# EAGLE design 2svd (EAGLE 6.4)
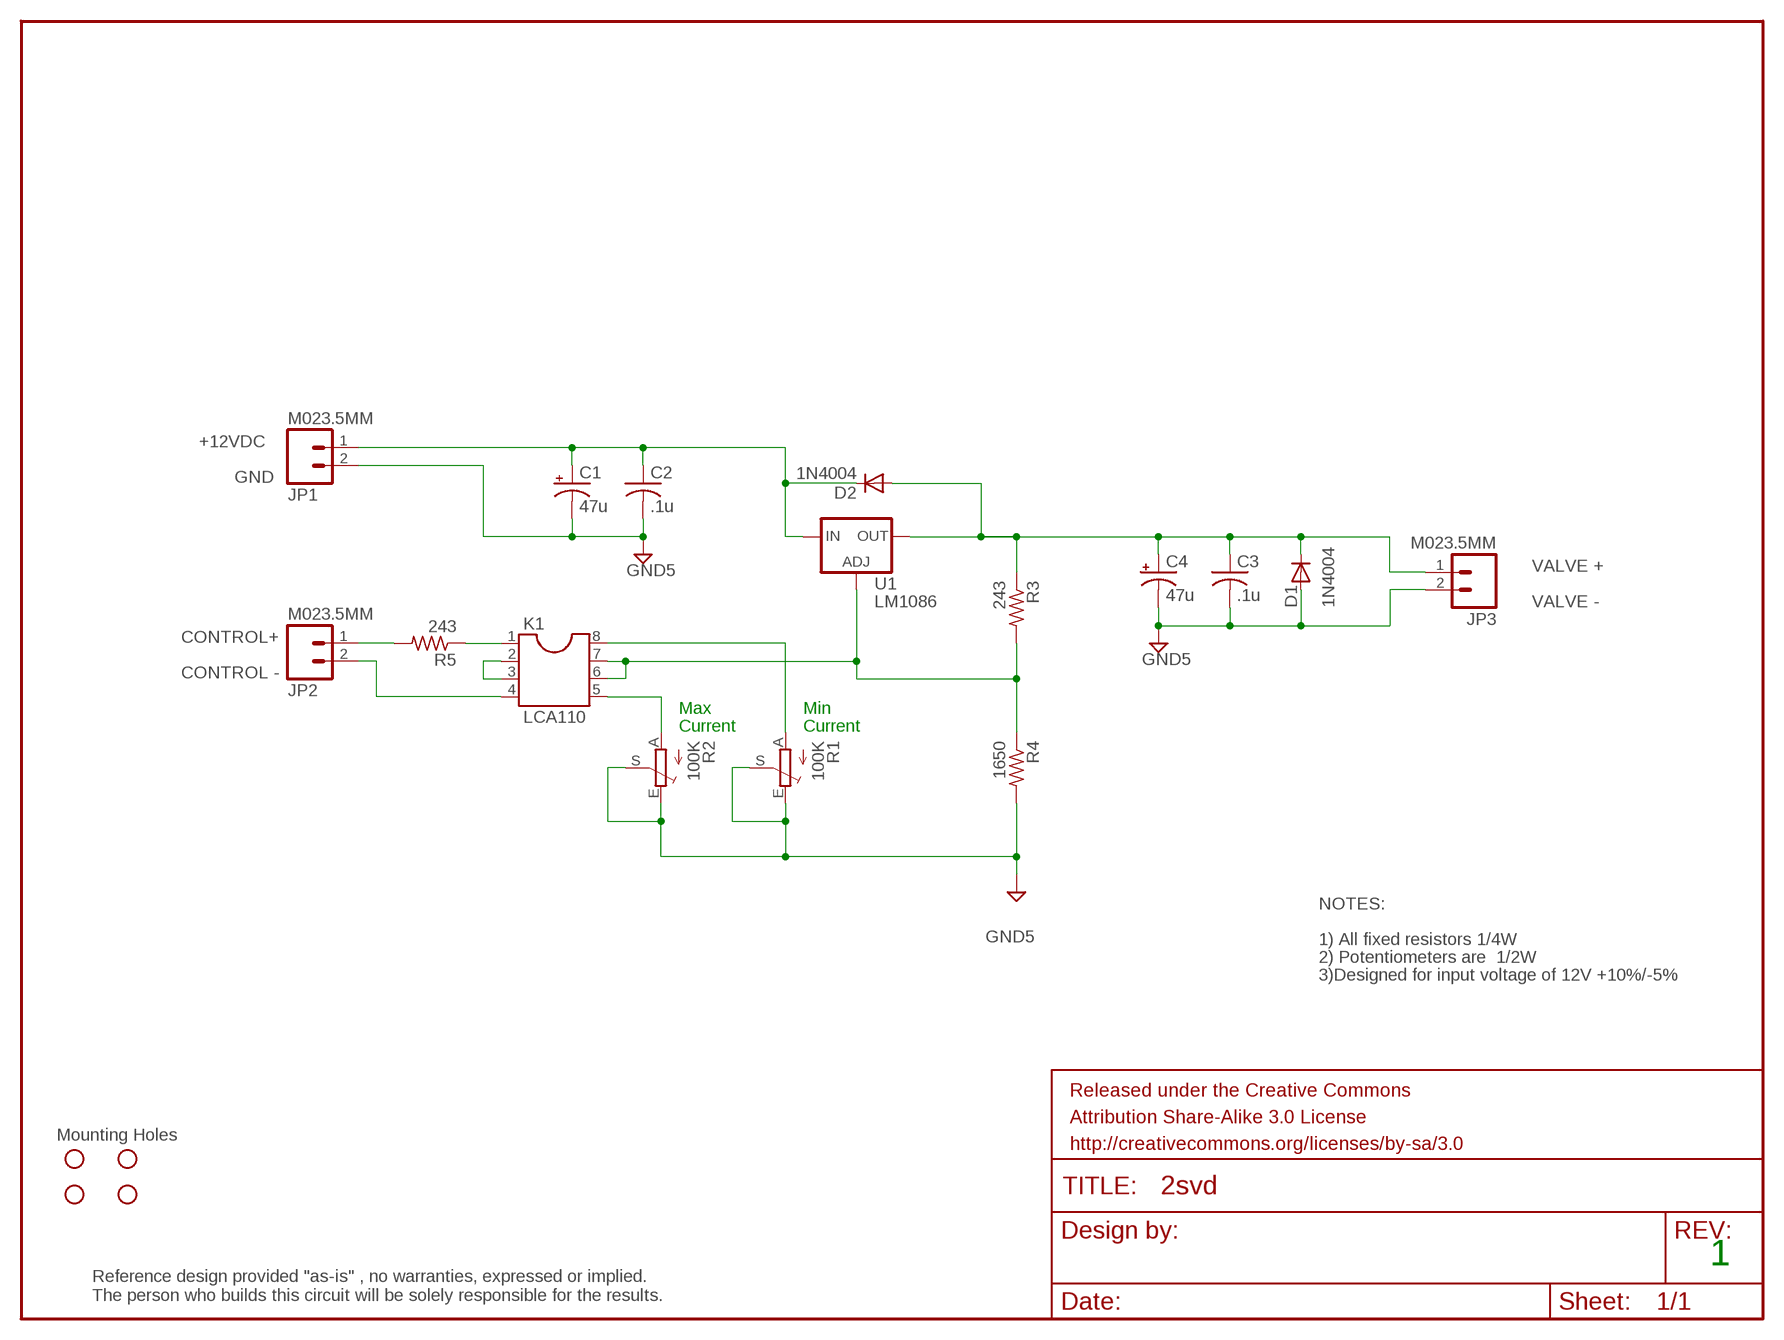
[diagram p0: schematic, sheet 1]

## Parts
C1  47u  CAP_POLPTH2  [CPOL-RADIAL-10UF-25V]
C2  .1u  C-US075-032X103  [C075-032X103]
C3  .1u  C-US075-032X103  [C075-032X103]
C4  47u  CAP_POLPTH2  [CPOL-RADIAL-10UF-25V]
D1  1N4004  [DO41-10]
D2  1N4004  [DO41-10]
FRAME1  FRAME-LETTER  [CREATIVE_COMMONS]
H1  STAND-OFF  [STAND-OFF]
H2  STAND-OFF  [STAND-OFF]
H3  STAND-OFF  [STAND-OFF]
H4  STAND-OFF  [STAND-OFF]
JP1  M023.5MM  [SCREWTERMINAL-3.5MM-2]
JP2  M023.5MM  [SCREWTERMINAL-3.5MM-2]
JP3  M023.5MM  [SCREWTERMINAL-3.5MM-2]
K1  LCA110  DIL8  [DIL08]
R1  100K  TRIM_EU-RJ9W  [RJ9W]
R2  100K  TRIM_EU-RJ9W  [RJ9W]
R3  243  R-US_0207/10  [0207/10]
R4  1650  R-US_0207/10  [0207/10]
R5  243  R-US_0207/10  [0207/10]
U1  LM1086  LM317TS  [317TS]

## Nets
N$1: K1.6 K1.7 R3.2 R4.1 U1.1(ADJ)
N$3 [power]: C3.1 C4.1(+) D1.C D2.A JP3.1 R3.1 U1.2(OUT)
N$4: K1.5 R2.A
N$5: K1.8 R1.A
N$7: K1.1 R5.1
N$9: K1.2 K1.3
N$10: JP2.2 K1.4
N$11 [power]: C1.1(+) C2.1 D2.C JP1.1 U1.3(IN)
N$12: JP2.1 R5.2
PE [gnd]: C1.2(-) C2.2 C3.2 C4.2(-) D1.A JP1.2 JP3.2 R1.E R1.S R2.E R2.S R4.2 ; supply symbol labelled GND5

## Notes on the sheet
- +12VDC
- GND
- VALVE +
- VALVE -
- CONTROL+
- CONTROL -
- Max | Min
- Current | Current
- NOTES:
- 1) All fixed resistors 1/4W
- 2) Potentiometers are  1/2W
- 3)Designed for input voltage of 12V +10%/-5%
- Mounting Holes
- 1
- Reference design provided "as-is" , no warranties, expressed or implied.
  The person who builds this circuit will be solely responsible for the results.

## Library data of the parts
C1 C4 = SparkFun-Capacitors:CAP_POL: Capacitor Polarized These are standard SMD and PTH capacitors. Normally 10uF, 47uF, and 100uF in electrolytic and tantalum varieties. Always verify the external diameter of the through hole cap, it varies with capacity, voltage, and manufacturer. The EIA devices should be standard.
C2 C3 = resistor:C-US: CAPACITOR, American symbol
D1 D2 = diode:1N4004: DIODE general purpose rectifier, 1 A
FRAME1 = SparkFun-Aesthetics:FRAME-LETTER: Schematic Frame Standard 8.5x11 US Letter frame
H1-H4 = SparkFun-Electromechanical:STAND-OFF: #4 Stand Off This is the mechanical footprint for a #4 phillips button head screw. Use the keepout ring to avoid running the screw head into surrounding components. SKU : PRT-00447
JP1-JP3 = SparkFun-Connectors:M02: Standard 2-pin 0.1" header. Use with - straight break away headers ( PRT-00116) - right angle break away headers (PRT-00553) - swiss pins (PRT-00743) - machine pins (PRT-00117) - female headers (PRT-00115) Molex polarized connector foot print use with: PRT-08233 with associated crimp pins and housings. 2.54_SCREWTERM for use with PRT-10571. 3.5mm Screw Terminal footprints for PRT-08084 5mm Screw Terminal footprints for use with PRT-08433
K1 = ic-package:DIL8: Dual In Line / Socket
R1 R2 = pot:TRIM_EU-: POTENTIOMETER
R3-R5 = resistor:R-US_: RESISTOR, American symbol
U1 = v-reg:LM317TS: VOLTAGE REGULATOR

## Net classes
0 default: width 0.254 mm, clearance 0.355 mm
1 power: width 1.27 mm, clearance 0.355 mm to class 0, clearance 0.355 mm
2 gnd: width 2.032 mm, clearance 0.355 mm to class 0, clearance 0.355 mm to class 1, clearance 0.355 mm

## Board
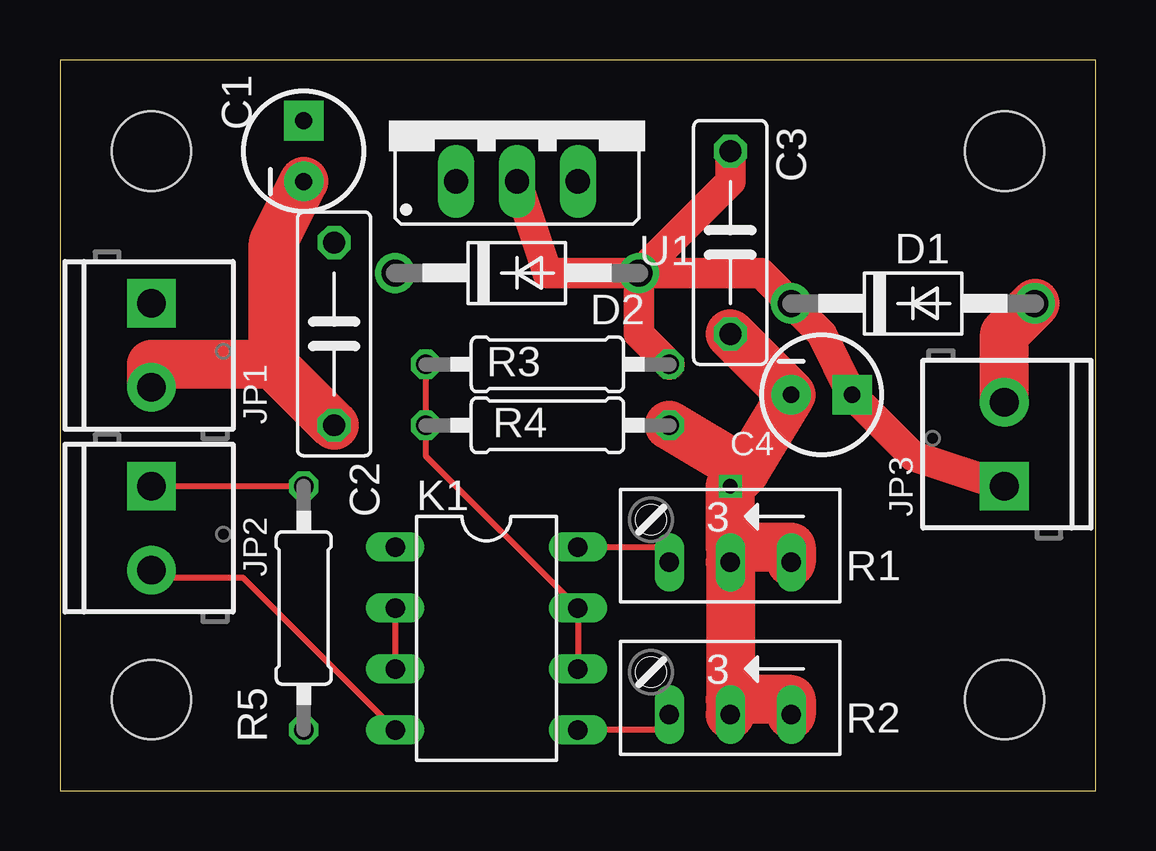
[diagram p1: board, top side]
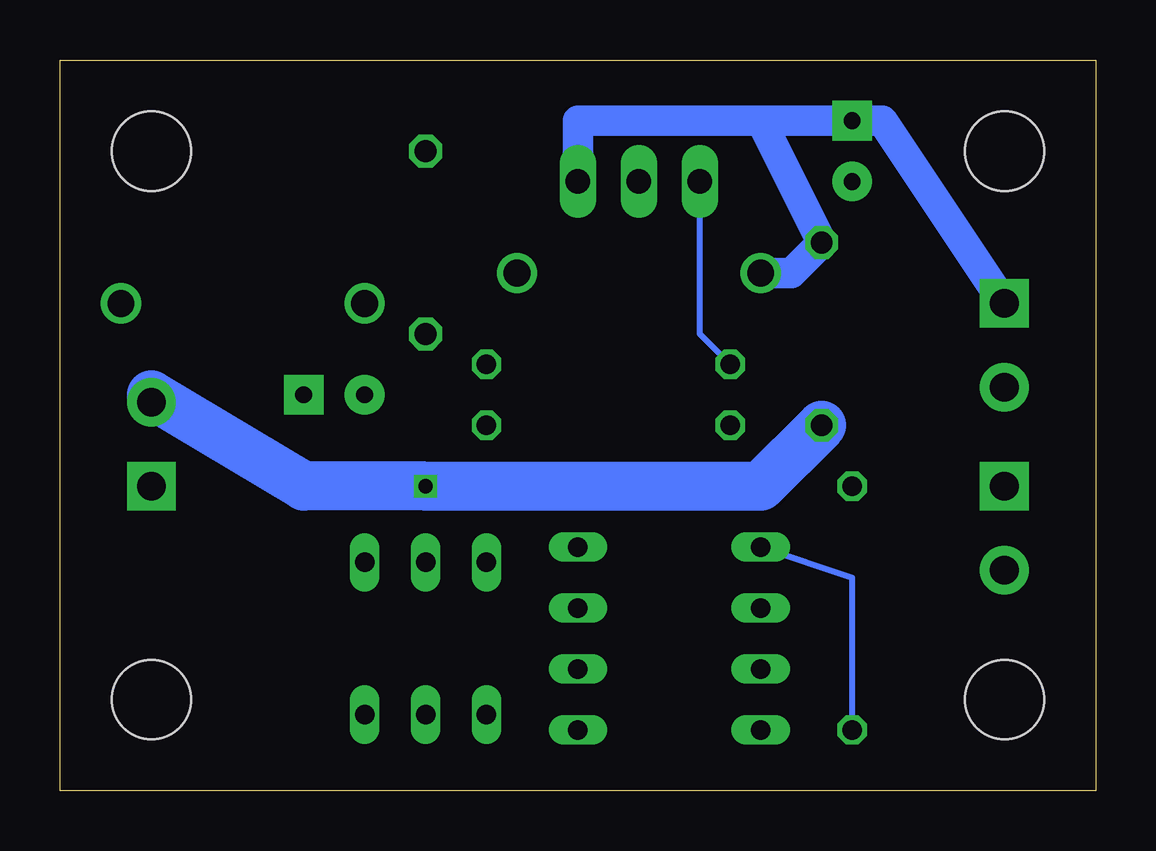
[diagram p2: board, bottom side, seen from below]

Size 43.18 x 30.47 mm. Coordinates in mm from the lower left corner, seen from the top.
Outline: 0,0 43.18,0 43.18,30.47 0,30.47 0,0
Copper layers (1*16): Top 0.0356mm / dielectric 1.5011mm / Bottom 0.0356mm
Design rules "oshpark": minimum track width 6mil, minimum drill 13mil, track to track 6mil, track to pad 6mil, pad to pad 6mil, via to via 6mil, smd to smd 6mil, copper to edge 15mil, drill to drill 6mil, minimum pad ring 7mil, minimum via ring 7mil, stop-mask expansion 4mil, vias tented up to drill 0mil, thermal gap 10mil

### Footprints (pad centres in the part's own frame; a part is rotated, then mirrored left to right if it is on the bottom)
CPOL-RADIAL-10UF-25V = drill 0.7 pad 1.651 square: 1 1.27,0 | drill 0.7 pad 1.651: 2 -1.27,0
C075-032X103 = drill 0.914 octagon: 1 -3.81,0; 2 3.81,0
DO41-10 = drill 1.118: A 5.08,0; C -5.08,0
STAND-OFF = hole 3.302: 0,0
SCREWTERMINAL-3.5MM-2 = drill 1.2 pad 2.032 square: 1 0,0 | drill 1.2 pad 2.032: 2 3.5,0
DIL08 = drill 0.813 long: 1 -3.81,-3.81; 2 -1.27,-3.81; 3 1.27,-3.81; 4 3.81,-3.81; 5 3.81,3.81; 6 1.27,3.81; 7 -1.27,3.81; 8 -3.81,3.81
RJ9W = drill 0.813 long: A 2.54,0.635; E -2.54,0.635; S 0,0.635
0207/10 = drill 0.813 octagon: 1 -5.08,0; 2 5.08,0
317TS = drill 1.016 long: 1 -2.54,-2.54; 2 0,-2.54; 3 2.54,-2.54

### Placement (x,y rotation side)
C1  10.16,26.67 90 top
C2  11.43,19.05 270 top
C3  27.94,22.86 270 top
C4  31.75,16.51 0 top
D1  35.56,20.32 0 top
D2  19.05,21.59 0 top
DRILEGEND  [DRILEGEND]  -9.48,-12.45 0 top  (outside the outline)
FRAME1  11.43,-7.62 0 top  (outside the outline)
H1  3.81,26.67 0 top
H2  39.37,26.67 0 top
H3  39.37,3.81 0 top
H4  3.81,3.81 0 top
JP1  3.81,20.32 270 top
JP2  3.81,12.7 270 top
JP3  39.37,12.7 90 top
K1  17.78,6.35 270 top
R1  27.94,10.16 180 top
R2  27.94,3.81 180 top
R3  20.32,17.78 180 top
R4  20.32,15.24 0 top
R5  10.16,7.62 90 top
U1  19.05,27.94 0 top

### Tracks (layer width: path | path; a pad name or v marks a point on that pad's centre or on a via)
N$1
  Top 0.254: R3.2 R4.1 15.24,13.97 K1.7 K1.6
  Bottom 0.254: U1.1 16.51,19.05 R3.2
N$3
  Top 1.27: R3.1 24.13,19.05 D2.A | U1.2 20.32,21.59 D2.A | JP3.1 35.56,13.97 C4.1 31.75,19.05 D1.C 29.21,21.59 D2.A | C3.1 27.94,25.4 D2.A
N$4
  Top 0.254: K1.5 25.4,2.54 R2.A
N$5
  Top 0.254: K1.8 25.4,10.16 R1.A
N$7
  Bottom 0.254: R5.1 10.16,8.89 K1.1
N$9
  Top 0.254: K1.2 K1.3
N$10
  Top 0.254: K1.4 7.62,8.89 3.81,8.89 JP2.2
N$11
  Bottom 1.27: U1.3 21.59,27.94 13.97,27.94 | D2.C 12.7,21.59 C2.1 13.97,27.94 | JP1.1 8.89,27.94 C1.1 13.97,27.94
N$12
  Top 0.254: JP2.1 R5.2
PE  (via drill 0.6)
  Top 2.032: D1.A 39.37,19.05 JP3.2 | C3.2 C4.2 28.57,13.34 | 27.94,3.81 30.48,3.81 R2.E | 27.94,10.16 v27.94,12.7 28.57,13.34 | 28.57,13.34 R4.2 | 27.94,10.16 30.48,10.16 R1.E | 27.94,10.16 R1.S 27.94,3.81 | 27.94,3.81 R2.S | C1.2 8.89,22.86 8.89,17.78 | C2.2 8.89,17.78 | 8.89,17.78 3.81,17.78 JP1.2
  Bottom 2.032: JP3.2 39.37,16.51 33.02,12.7 v27.94,12.7 13.97,12.7 C2.2

### Text on the board
_bsilk: Rv1 | 2SVD
DrillLegend: LAYER-STACK
DrillLegend_01-16: 01-16
DrillLegend_01-20: 01-20